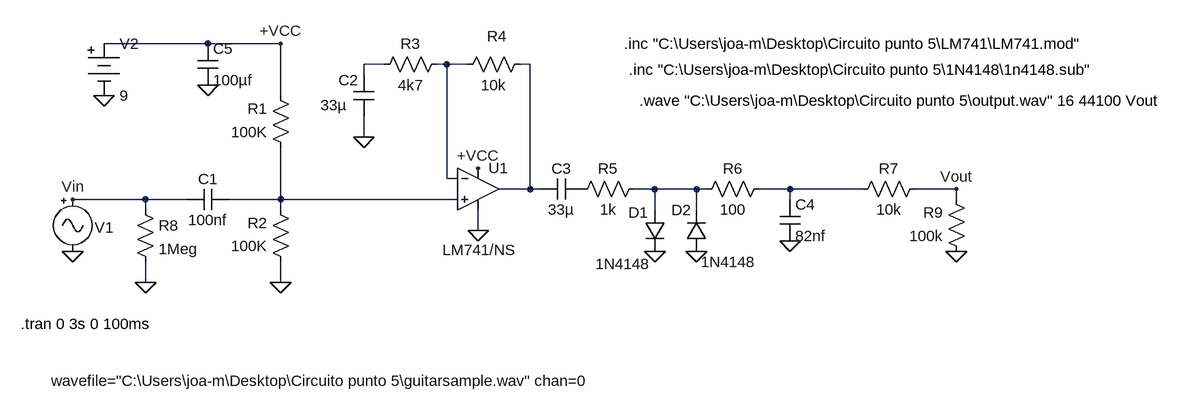
[diagram p0: schematic punto 5 nuevos valores wav.asc]
punto 5 nuevos valores wav.asc, the LTspice schematic file:
Version 4
SHEET 1 1228 680
WIRE -288 -80 -448 -80
WIRE -176 -80 -288 -80
WIRE -16 -48 -48 -48
WIRE 80 -48 64 -48
WIRE 112 -48 80 -48
WIRE 208 -48 192 -48
WIRE -48 -32 -48 -48
WIRE -176 0 -176 -80
WIRE -48 64 -48 32
WIRE 80 128 80 -48
WIRE 96 128 80 128
WIRE 208 144 208 -48
WIRE 208 144 160 144
WIRE 224 144 208 144
WIRE 400 144 368 144
WIRE 464 144 400 144
WIRE 480 144 464 144
WIRE 608 144 560 144
WIRE 720 144 608 144
WIRE 864 144 800 144
WIRE -384 160 -496 160
WIRE -320 160 -384 160
WIRE -176 160 -176 80
WIRE -176 160 -256 160
WIRE 96 160 -176 160
WIRE 608 160 608 144
WIRE 864 160 864 144
WIRE -384 176 -384 160
WIRE -176 176 -176 160
WIRE 400 176 400 144
WIRE 464 176 464 144
WIRE 128 208 128 176
WIRE -384 288 -384 256
WIRE -176 288 -176 256
FLAG -48 64 0
FLAG 400 240 0
FLAG 464 240 0
FLAG 608 224 0
FLAG 128 208 0
FLAG -176 288 0
FLAG -288 -16 0
FLAG -384 288 0
FLAG -496 240 0
FLAG -448 0 0
FLAG 864 144 Vout
FLAG -496 160 Vin
FLAG 864 240 0
FLAG -176 -80 +VCC
FLAG 128 112 +VCC
SYMBOL Opamps\\opamp2 128 80 R0
WINDOW 3 -55 158 Left 2
SYMATTR Value LM741/NS
SYMATTR InstName U1
SYMBOL res -160 96 R180
WINDOW 0 36 76 Left 2
WINDOW 3 36 40 Left 2
SYMATTR InstName R1
SYMATTR Value 100K
SYMBOL res -160 272 R180
WINDOW 0 36 76 Left 2
WINDOW 3 36 40 Left 2
SYMATTR InstName R2
SYMATTR Value 100K
SYMBOL res -32 -32 R270
WINDOW 0 32 56 VTop 2
WINDOW 3 0 56 VBottom 2
SYMATTR InstName R3
SYMATTR Value 4k7
SYMBOL res 208 -64 R90
WINDOW 0 -12 51 VBottom 2
WINDOW 3 32 56 VTop 2
SYMATTR InstName R4
SYMATTR Value 10k
SYMBOL res 384 128 R90
WINDOW 0 0 56 VBottom 2
WINDOW 3 32 56 VTop 2
SYMATTR InstName R5
SYMATTR Value 1k
SYMBOL cap -256 144 R90
WINDOW 0 0 32 VBottom 2
WINDOW 3 32 32 VTop 2
SYMATTR InstName C1
SYMATTR Value 100nf
SYMBOL cap -32 32 R180
WINDOW 0 24 56 Left 2
WINDOW 3 42 17 Left 2
SYMATTR InstName C2
SYMATTR Value 33µ
SYMBOL cap 224 160 R270
WINDOW 0 32 32 VTop 2
WINDOW 3 0 32 VBottom 2
SYMATTR InstName C3
SYMATTR Value 33µ
SYMBOL res 576 128 R90
WINDOW 0 0 56 VBottom 2
WINDOW 3 32 56 VTop 2
SYMATTR InstName R6
SYMATTR Value 100
SYMBOL cap 592 160 R0
SYMATTR InstName C4
SYMATTR Value 82nf
SYMBOL diode 384 176 R0
WINDOW 0 -25 4 Left 2
WINDOW 3 87 80 Left 2
SYMATTR InstName D1
SYMATTR Value 1N4148
SYMBOL diode 480 240 R180
WINDOW 0 24 64 Left 2
WINDOW 3 87 -19 Left 2
SYMATTR InstName D2
SYMATTR Value 1N4148
SYMBOL res -400 160 R0
SYMATTR InstName R8
SYMATTR Value 1Meg
SYMBOL cap -304 -80 R0
SYMATTR InstName C5
SYMATTR Value 100µf
SYMBOL Misc\\battery -448 -96 R0
WINDOW 123 0 0 Left 2
WINDOW 39 0 0 Left 2
SYMATTR InstName V2
SYMATTR Value 9
SYMBOL Misc\\signal -496 144 R0
WINDOW 3 -33 295 Left 2
WINDOW 123 0 0 Left 2
WINDOW 39 0 0 Left 2
WINDOW 0 34 59 Left 2
SYMATTR Value wavefile="C:\Users\joa-m\Desktop\Circuito punto 5\guitarsample.wav" chan=0
SYMATTR InstName V1
SYMBOL res 816 128 R90
WINDOW 0 0 56 VBottom 2
WINDOW 3 32 56 VTop 2
SYMATTR InstName R7
SYMATTR Value 10k
SYMBOL res 880 256 R180
WINDOW 0 36 76 Left 2
WINDOW 3 36 40 Left 2
SYMATTR InstName R9
SYMATTR Value 100k
TEXT 352 -80 Left 2 !.inc "C:\\Users\\joa-m\\Desktop\\Circuito punto 5\\LM741\\LM741.mod"
TEXT 360 -40 Left 2 !.inc "C:\\Users\\joa-m\\Desktop\\Circuito punto 5\\1N4148\\1n4148.sub"
TEXT -576 352 Left 2 !.tran 0 3s 0 100ms
TEXT 376 8 Left 2 !.wave "C:\\Users\\joa-m\\Desktop\\Circuito punto 5\\output.wav" 16 44100 Vout

The netlist it stands for:
* punto 5 nuevos valores wav.asc
XU1 N006 N002 +VCC 0 N003 LM741/NS  ; pins In+ In- V+ V- OUT
R1 N006 +VCC 100K
R2 0 N006 100K
R3 N001 N002 4k7
R4 N003 N002 10k
R5 N004 P001 1k
C1 N006 Vin 100nf
C2 0 N001 33µ
C3 N003 P001 33µ
R6 N005 N004 100
C4 N005 0 82nf
D1 N004 0 1N4148
D2 0 N004 1N4148
R8 Vin 0 1Meg
C5 +VCC 0 100µf
V2 +VCC 0 9
V1 Vin 0 wavefile="C:\Users\joa-m\Desktop\Circuito punto 5\guitarsample.wav" chan=0
R7 Vout N005 10k
R9 0 Vout 100k
.model D D
.lib standard.dio
.inc "C:\Users\joa-m\Desktop\Circuito punto 5\LM741\LM741.mod"
.inc "C:\Users\joa-m\Desktop\Circuito punto 5\1N4148\1n4148.sub"
.tran 0 3s 0 100ms
.wave "C:\Users\joa-m\Desktop\Circuito punto 5\output.wav" 16 44100 Vout
.backanno
.end